# EAGLE schematic ABITW (EAGLE 7.7.0)
SCALE: 1:1; SCHEMATIC_NAME: RECO0.16.018.01.00.00.E3; STUDENT: D. Palamarčuks; THESIS_SUPERVISOR: I. Galkins

## Sheet 1 of 2
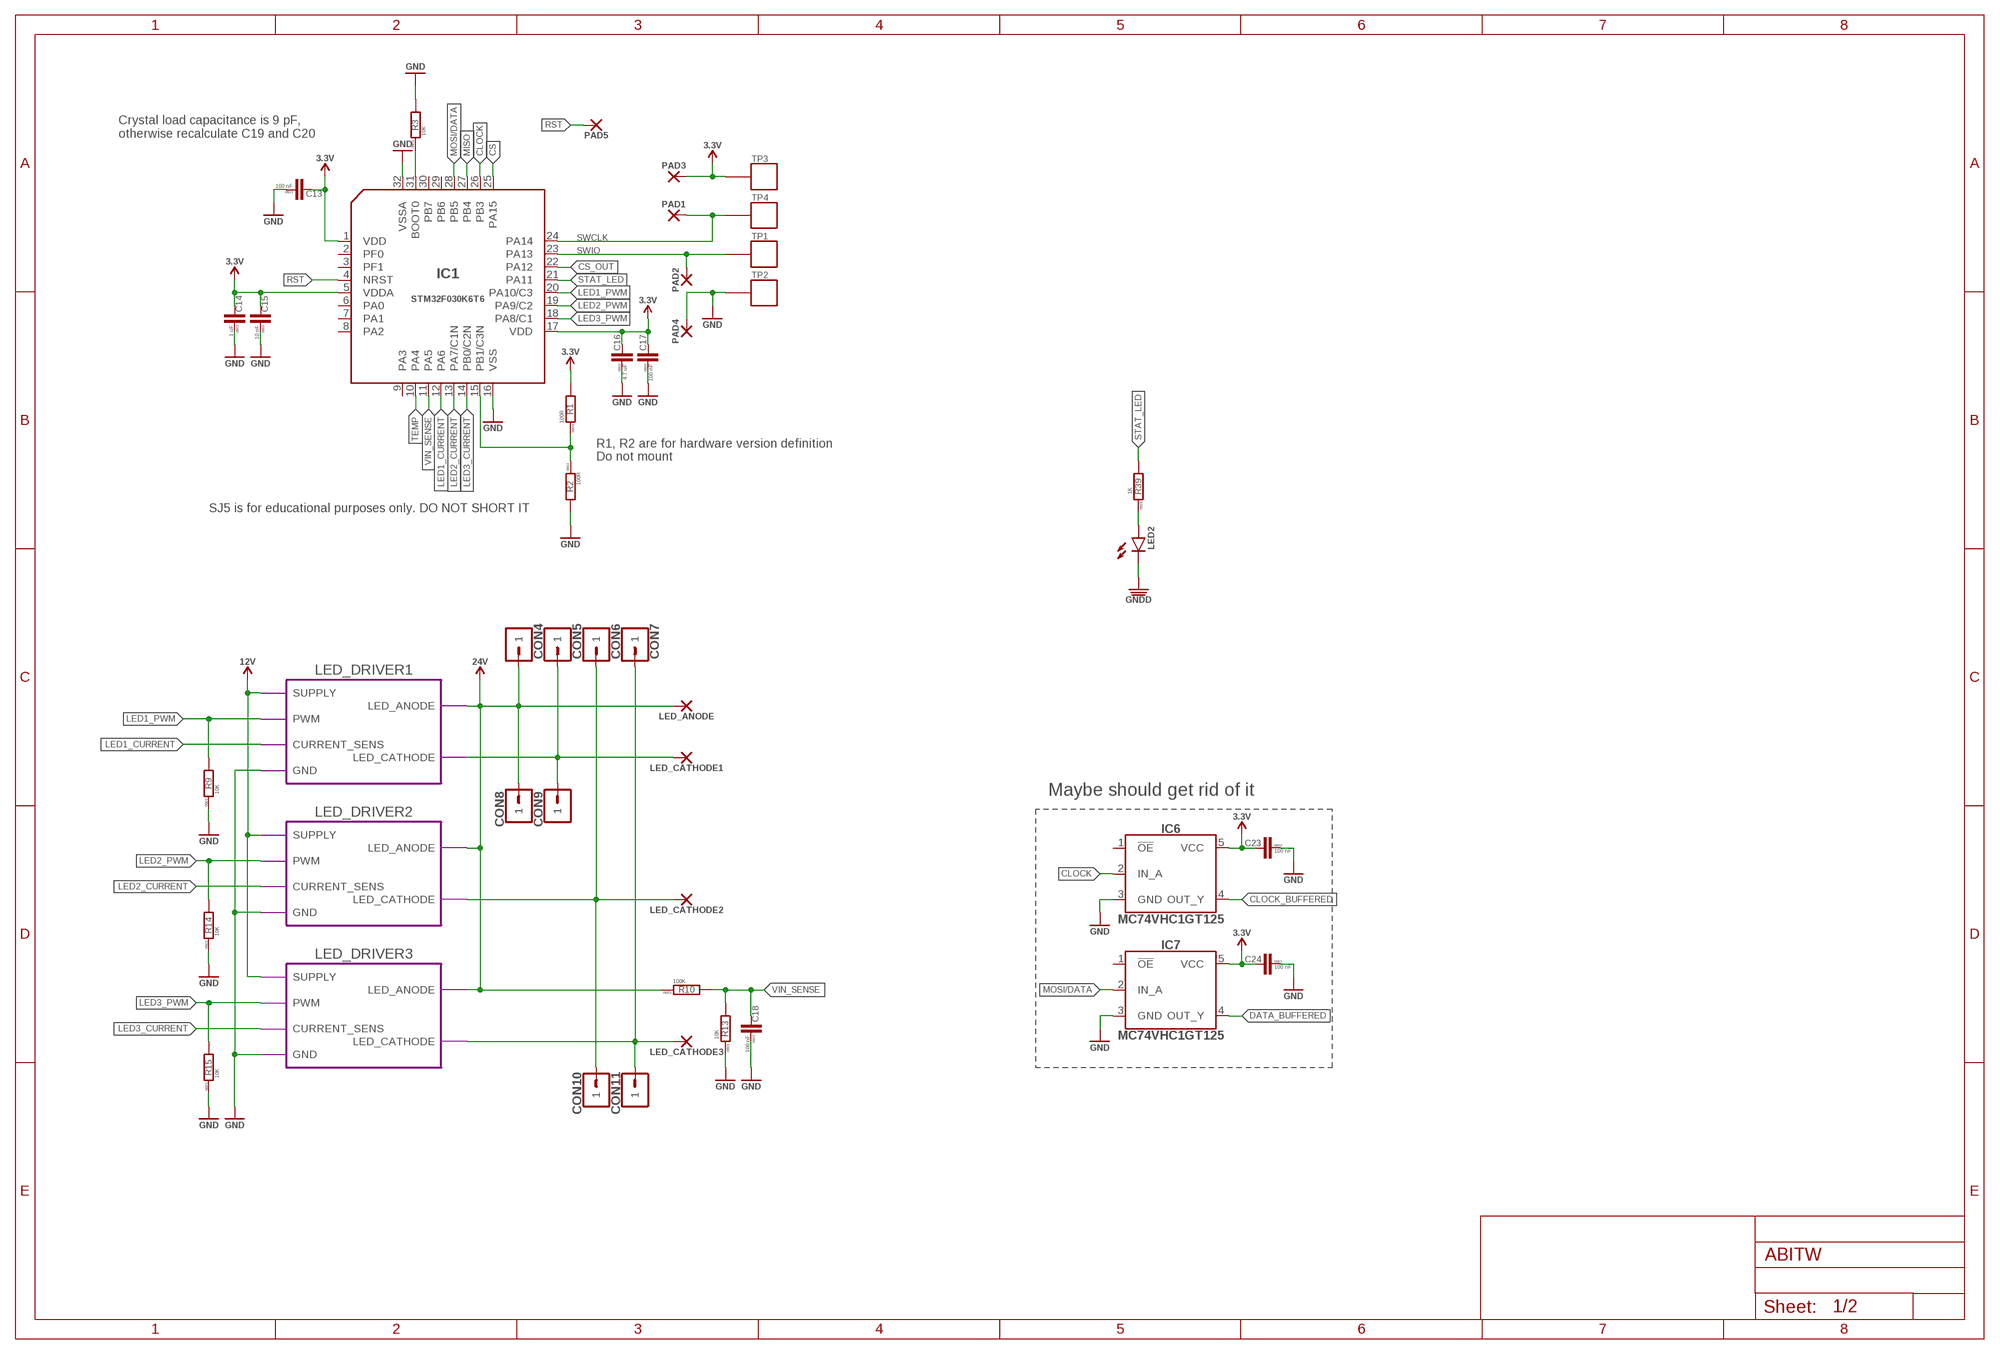
[diagram p0: schematic, sheet 1]

### Parts
C13  100 nF  C-0603  [C0603]
C14  1 uF  C-0603  [C0603]
C15  10 nF  C-0603  [C0603]
C16  4.7 uF  C-0603  [C0603]
C17  100 nF  C-0603  [C0603]
C18  100 nF  C-0603  [C0603]
C23  100 nF  C-0603  [C0603]
C24  100 nF  C-0603  [C0603]
CON4  PINHEAD_1X01-2.54  [1X01-PTH-2.54]
CON5  PINHEAD_1X01-2.54  [1X01-PTH-2.54]
CON6  PINHEAD_1X01-2.54  [1X01-PTH-2.54]
CON7  PINHEAD_1X01-2.54  [1X01-PTH-2.54]
CON8  PINHEAD_1X01-2.54  [1X01-PTH-2.54]
CON9  PINHEAD_1X01-2.54  [1X01-PTH-2.54]
CON10  PINHEAD_1X01-2.54  [1X01-PTH-2.54]
CON11  PINHEAD_1X01-2.54  [1X01-PTH-2.54]
IC1  STM32F030K6TX-LQFP32(7X7)  [LQFP32-7X7]
IC6  MC74VHC1GT125  [SOT23-5]
IC7  MC74VHC1GT125  [SOT23-5]
LED2  LED-0603  [LED0603]
LED_ANODE  WIREPADSMD2.5-1.8  [PAD-2.5-1.8]
LED_CATHODE1  WIREPADSMD2.5-1.8  [PAD-2.5-1.8]
LED_CATHODE2  WIREPADSMD2.5-1.8  [PAD-2.5-1.8]
LED_CATHODE3  WIREPADSMD2.5-1.8  [PAD-2.5-1.8]
PAD1  WIREPADSMD2.5-1.8  [PAD-2.5-1.8]
PAD2  WIREPADSMD2.5-1.8  [PAD-2.5-1.8]
PAD3  WIREPADSMD2.5-1.8  [PAD-2.5-1.8]
PAD4  WIREPADSMD2.5-1.8  [PAD-2.5-1.8]
PAD5  WIREPADSMD2.5-1.8  [PAD-2.5-1.8]
R1  100R  R-0603  [R0603]
R2  100R  R-0603  [R0603]
R3  10K  R-0603  [R0603]
R9  10K  R-0603  [R0603]
R10  100K  R-0603  [R0603]
R13  10K  R-0603  [R0603]
R14  10K  R-0603  [R0603]
R15  10K  R-0603  [R0603]
R39  1K  R-0603  [R0603]
TP1  PAD.05  [PAD.05X.05]
TP2  PAD.05  [PAD.05X.05]
TP3  PAD.05  [PAD.05X.05]
TP4  PAD.05  [PAD.05X.05]

### Module instances
LED_DRIVER1 = LED_DRIVER (part numbers offset by 100)
LED_DRIVER2 = LED_DRIVER (part numbers offset by 200)
LED_DRIVER3 = LED_DRIVER (part numbers offset by 300)

### Nets
CLOCK: IC1.26(PB3) IC6.2(IN_A)
CLOCK_BUFFERED: IC6.4(OUT_Y)
CS: IC1.25(PA15)
CS_OUT: IC1.22(PA12)
DATA_BUFFERED: IC7.4(OUT_Y)
GND: C13.1 C14.1 C15.1 C16.1 C17.1 C18.1 C23.1 C24.1 IC1.16(VSS) IC1.32(VSSA) IC6.3(GND) IC7.3(GND) PAD4.P$1(P) R2.2 R3.2 R9.1 R13.1 R14.1 R15.1 TP2.P$1 ; port LED_DRIVER1.GND LED_DRIVER3.GND LED_DRIVER2.GND ; also sheet 2
GNDD: LED2.C
LED1_CURRENT: IC1.12(PA6) ; port LED_DRIVER1.CURRENT_SENS
LED1_PWM: IC1.20(PA10/C3) R9.2 ; port LED_DRIVER1.PWM
LED2_CURRENT: IC1.13(PA7/C1N) ; port LED_DRIVER2.CURRENT_SENS
LED2_PWM: IC1.19(PA9/C2) R14.2 ; port LED_DRIVER2.PWM
LED3_CURRENT: IC1.14(PB0/C2N) ; port LED_DRIVER3.CURRENT_SENS
LED3_PWM: IC1.18(PA8/C1) R15.2 ; port LED_DRIVER3.PWM
MISO: IC1.27(PB4)
MOSI/DATA: IC1.28(PB5) IC7.2(IN_A)
N$3: IC1.15(PB1/C3N) R1.1 R2.1
N$6: IC1.31(BOOT0) R3.1
N$10: CON5.1 CON9.1 LED_CATHODE1.P$1(P) ; port LED_DRIVER1.LED_CATHODE
N$21: CON6.1 CON10.1 LED_CATHODE2.P$1(P) ; port LED_DRIVER2.LED_CATHODE
N$22: LED2.A R39.1
N$23: CON7.1 CON11.1 LED_CATHODE3.P$1(P) ; port LED_DRIVER3.LED_CATHODE
RST: IC1.4(NRST) PAD5.P$1(P)
STAT_LED: IC1.21(PA11) R39.2
SWCLK: IC1.24(PA14) PAD1.P$1(P) TP4.P$1
SWIO: IC1.23(PA13) PAD2.P$1(P) TP1.P$1
TEMP: IC1.10(PA4)
VDD_3V3: C13.2 C14.2 C15.2 C16.2 C17.2 C23.2 C24.2 IC1.1(VDD) IC1.5(VDDA) IC1.17(VDD) IC6.5(VCC) IC7.5(VCC) PAD3.P$1(P) R1.2 TP3.P$1 ; supply symbol labelled 3.3V ; also sheet 2
VDD_12V: port LED_DRIVER2.SUPPLY LED_DRIVER1.SUPPLY LED_DRIVER3.SUPPLY ; supply symbol labelled 12V
VDD_24V: CON4.1 CON8.1 LED_ANODE.P$1(P) R10.1 ; port LED_DRIVER1.LED_ANODE LED_DRIVER3.LED_ANODE LED_DRIVER2.LED_ANODE ; supply symbol labelled 24V ; also sheet 2
VIN_SENSE: C18.2 IC1.11(PA5) R10.2 R13.2
Unconnected: IC1.2(PF0) IC1.3(PF1) IC1.6(PA0) IC1.7(PA1) IC1.8(PA2) IC1.9(PA3) IC1.29(PB6) IC1.30(PB7) IC6.1(!OE) IC7.1(!OE)

### Notes on the sheet
- Crystal load capacitance is 9 pF,
  otherwise recalculate C19 and C20
- R1, R2 are for hardware version definition
- Do not mount
- SJ5 is for educational purposes only. DO NOT SHORT IT
- Maybe should get rid of it

## Sheet 2 of 2: DC-DC converter
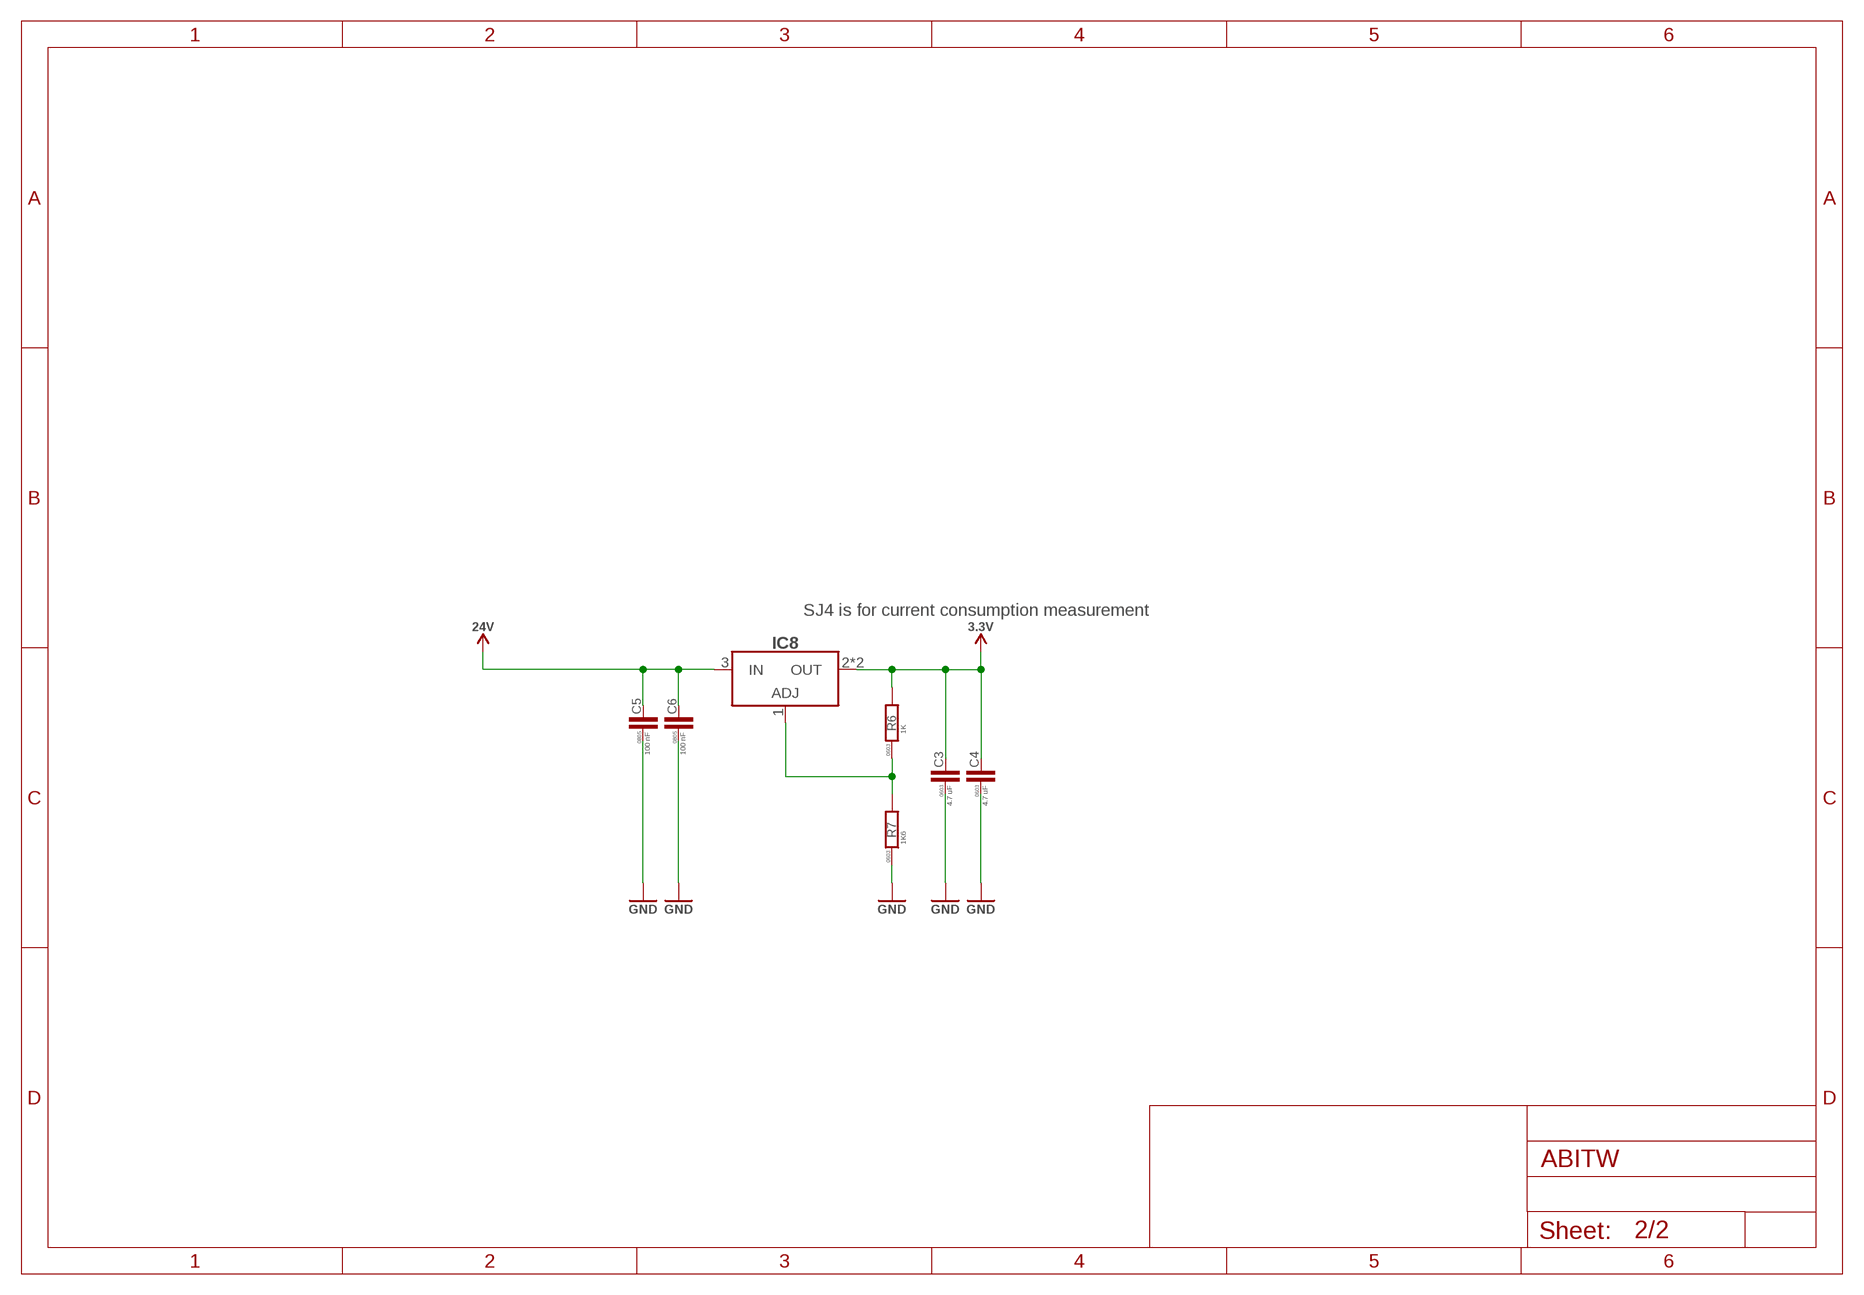
[diagram p1: schematic, sheet 2]

### Parts
C3  4.7 uF  C-0603  [C0603]
C4  4.7 uF  C-0603  [C0603]
C5  100 nF  C-0805  [C0805]
C6  100 nF  C-0805  [C0805]
IC8  LM317  [SOT223]
R6  1K  R-0603  [R0603]
R7  1K6  R-0603  [R0603]

### Nets
GND: C3.1 C4.1 C5.1 C6.1 R7.1 ; also sheet 1
N$20: IC8.1(ADJ) R6.1 R7.2
VDD_3V3: C3.2 C4.2 IC8.2(OUT) IC8.4(OUT) R6.2 ; supply symbol labelled 3.3V ; also sheet 1
VDD_24V: C5.2 C6.2 IC8.3(IN) ; supply symbol labelled 24V ; also sheet 1

### Notes on the sheet
- SJ4 is for current consumption measurement

## Library data of the parts
C3 C4 C16 = rc:C; FARNELL#: 2496930; PACKAGE: 0603; TME#: GRM188R60J475KE19D
C5 C6 = rc:C; FARNELL#: 2496834; PACKAGE: 0805; TME#: GRM188R71H104KA93D
C13 C17 C18 C23 C24 = rc:C; FARNELL#: 2496834; PACKAGE: 0603; TME#: GRM188R71H104KA93D
C14 = rc:C; FARNELL#: 2496917; PACKAGE: 0603; TME#: GRM188R61C105KA93D
C15 = rc:C; FARNELL#: 2496827; PACKAGE: 0603; TME#: C0603C103K3RAC
CON4-CON11 = pinhead:PINHEAD_1X01: pinheader 1P
IC1 = pixel_masterlib:STM32F030K6TX: MCU 32BIT 32KB FLASH 32LQFP; CHIPDIP#: 9000250493; DIGIKEY#: 497-14046-ND; FARNELL#: 2432085; MANF: STMicroelectronics; MANF#: STM32F030K6T6; TME#: STM32F030K6T6
IC6 IC7 = pixel_masterlib:MC74VHC1GT125: Buffer, Non-Inverting 1 Element 1 Bit per Element Push-Pull Output 5-TSOP; CHIPDIP#: 9000014391; DIGIKEY#: MC74VHC1GT125DT1GOSDKR-ND; FARNELL#: 2101847; MANF: ON Semiconductor; MANF#: MC74VHC1GT125
IC8 = pixel_masterlib:LM317: Linear Voltage Regulator IC Positive Adjustable 1 Output 1.2 V ~ 37 V 500mA SOT-223; CHIPDIP#: LM317DCY; DIGIKEY#: 296-23224-5-ND; FARNELL#: 2112605; MANF: Texas Instruments; MANF#: LM317MSTT3G; TME#: LM317DCY
LED2 = rc:LED: SMD LED; CHIPDIP#: 8598509892; COLOR: GREEN; DIGIKEY#: 160-1446-1-ND; FARNELL#: 2293494; MANF: Lite-On Inc; MANF#: LTST-C191KGKT; TME#: LTST-C191KGKT
LED_ANODE LED_CATHODE1-LED_CATHODE3 PAD1-PAD5 = wirepad:WIREPAD: Wire PAD connect wire on PCB; BOM: EXCLUDE
R1 R2 = rc:R; ASSY: DO NOT MOUNT; PACKAGE: 0603
R3 R9 R13-R15 = rc:R; FARNELL#: 2008341; PACKAGE: 0603; TME#: RC0603FR-0710K
R6 R39 = rc:R; FARNELL#: 2303145; PACKAGE: 0603; TME#: RC0603FR-071K
R7 = rc:R; FARNELL#: 2303159; PACKAGE: 0603; TME#: RC0603FR-071K6
R10 = rc:R; FARNELL#: 2303232; PACKAGE: 0603; TME#: RC0603FR-07100K
TP1-TP4 = misc:PAD: Test pad This footprint includes three classes: The actual test pads, a pogo-pin footprint to mount the pogo-pin as through-hole part and a hole footprint which allows the head of the pogo-pin to pass through (do NOT use the hole to mount the pogo-pin). In a typical test setup, the stack would consist of three PCBs: The actual PCB under testing with a test pad on the bottom, then a second PCB with the hole for the pogo-pin head where the PCB under testing is pressed on and a third PCB at 30 mm / 1.2" distance with the pogo-pin footprints. The pogo-pins are soldered to the last PCB. To create the stack, copy the board under testing and exchange the footprints - this way the correct positioning is ensured.; BOM: EXCLUDE; PARTNO: *

## Module LED_DRIVER
Ports: GND(pwr) PWM(in) CURRENT_SENS(out) LED_ANODE(pwr) LED_CATHODE(pwr) SUPPLY(pwr)
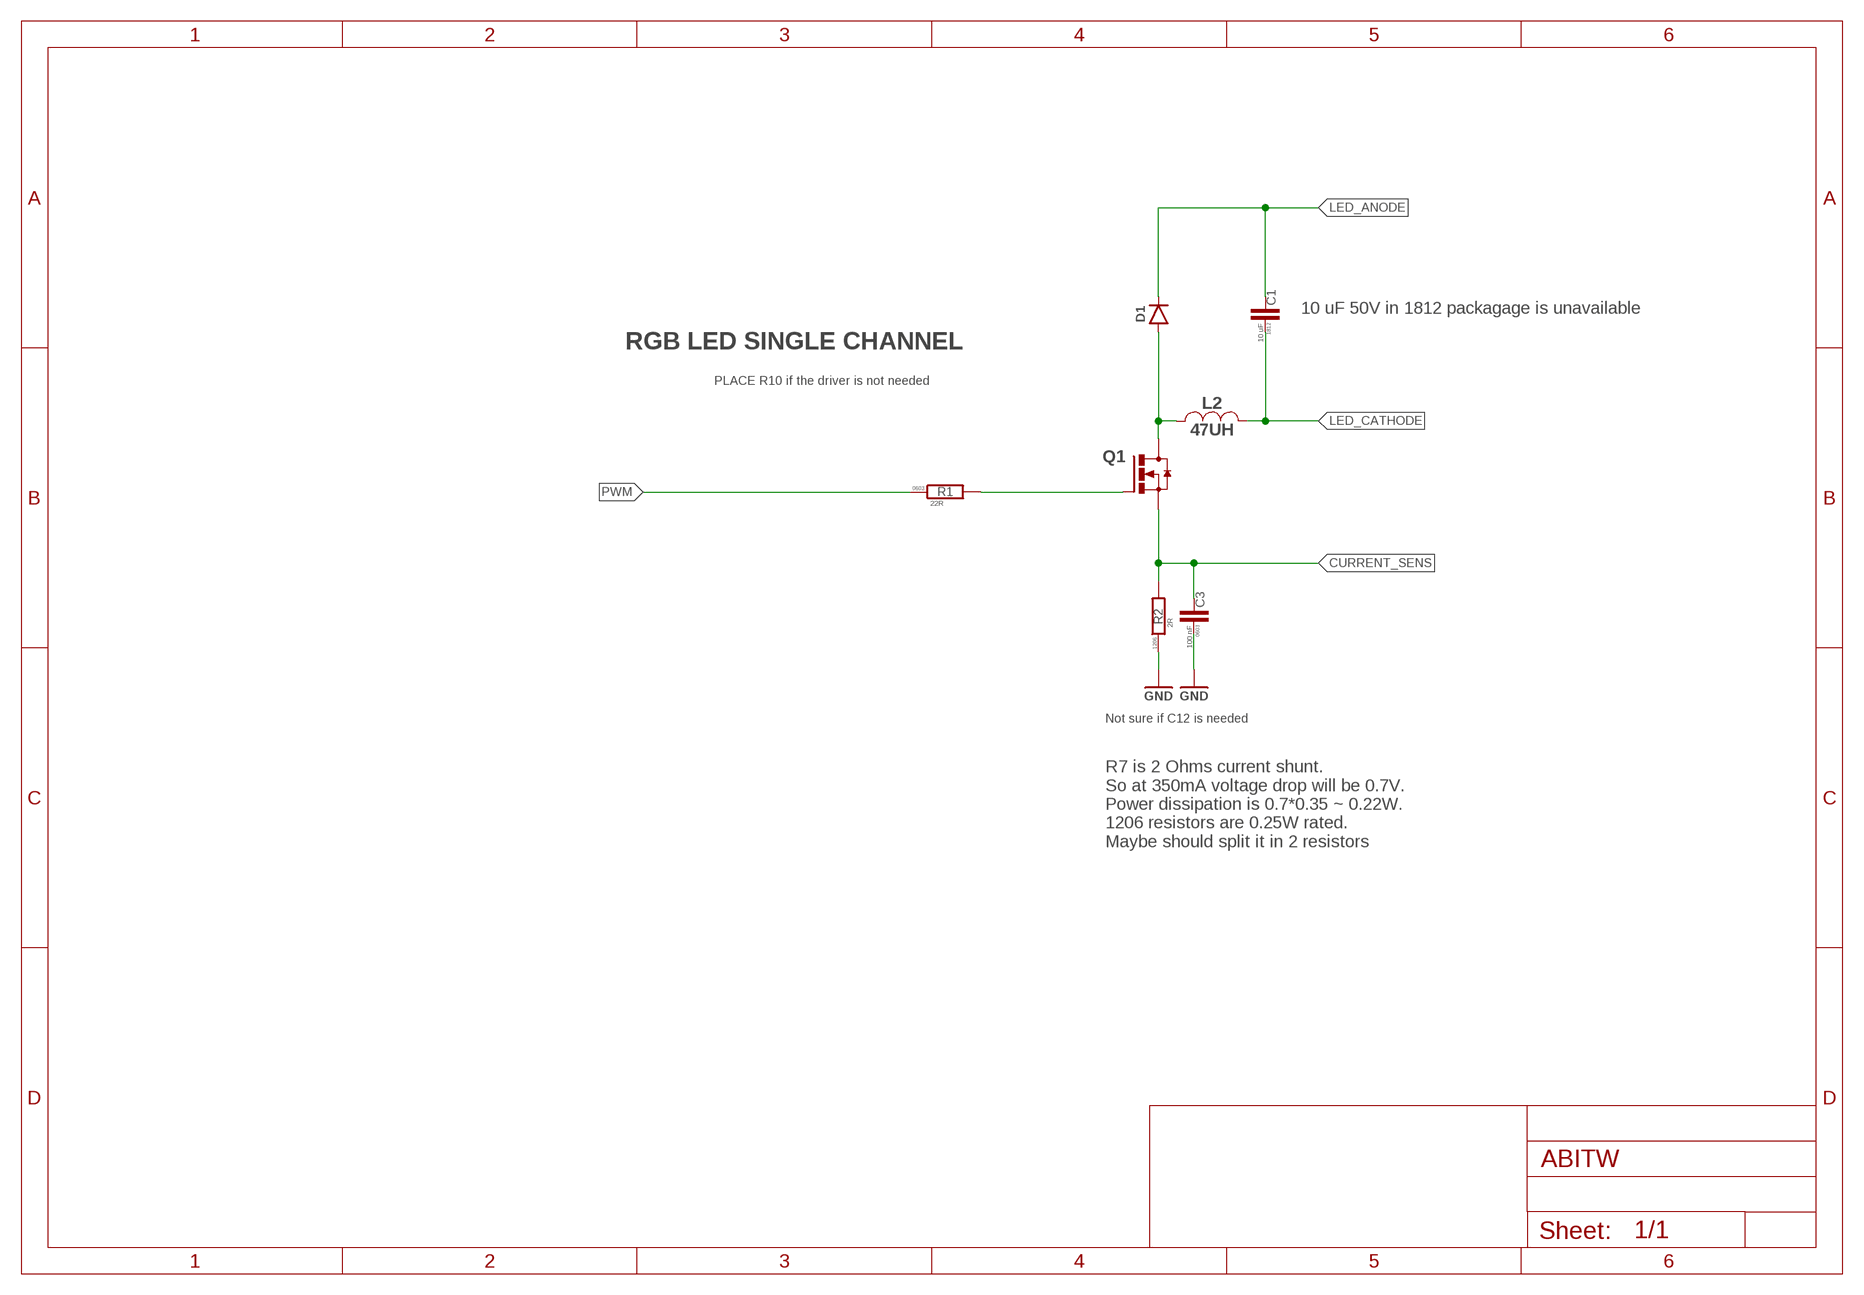
[diagram p2: schematic, module LED_DRIVER, sheet 1]

### Parts
C1  10 uF  C-1812  [C1812]
C3  100 nF  C-0603  [C0603]
D1  DIODE-SOD123  [SOD123]
L2  47UH  INDUCTOR-470KL-SDR0604  [SDR0604]
Q1  N-FET-SOT23  [SOT23-3]
R1  22R  R-0603  [R0603]
R2  2R  R-R1206  [R1206]

### Nets
CURRENT_SENS: C3.2 Q1.2(S) R2.P$2
GND: C3.1 R2.P$1
LED_ANODE: C1.P$2 D1.C
LED_CATHODE: C1.P$1 L2.2
N$2: D1.A L2.1 Q1.3(D)
N$7: Q1.1(G) R1.2
PWM: R1.1

### Notes on the sheet
- 10 uF 50V in 1812 packagage is unavailable
- RGB LED SINGLE CHANNEL
- PLACE R10 if the driver is not needed
- Not sure if C12 is needed
- R7 is 2 Ohms current shunt. 
  So at 350mA voltage drop will be 0.7V. 
  Power dissipation is 0.7*0.35 ~ 0.22W. 
  1206 resistors are 0.25W rated. 
  Maybe should split it in 2 resistors

### Library data of the parts
C1 = rc:C; FARNELL#: 2449143; PACKAGE: 1812; TME#: CL32B106KBJNNNE
C3 = rc:C; FARNELL#: 2496834; PACKAGE: 0603; TME#: GRM188R71H104KA93D
D1 = pixel_masterlib:DIODE; CHIPDIP#: MBRS1100T3G; DIGIKEY#: MBRS1100T3GOSCT-ND; FARNELL#: 9555862; MANF: ON Semiconductor; MANF#: MBRS1100T3G; TME#: MBRS1100T3G
L2 = power_inductors:INDUCTOR: Unshielded Wirewound Inductor; DIGIKEY#: SDR0604-470KLCT-ND; MANF: Bourns Inc; MANF#: SDR0604-470KL
Q1 = pixel_masterlib:N-FET; CHIPDIP#: 9000095041; DIGIKEY#: IRLML0040TRPBFCT-ND; FARNELL#: 1831088; MANF: Infineon Technologies; MANF#: IRLML0040TRPBF; TME#: IRLML0040TRPBF
R1 = rc:R; FARNELL#: 2302996; PACKAGE: 0603; TME#: CRCW060322R0FKEA
R2 = rc:R; FARNELL#: 2502621; PACKAGE: 1206; TME#: RC1206FR-072R

## Net classes
4 USBpair: width 0.152 mm, drill 0.305 mm, clearance 0.152 mm